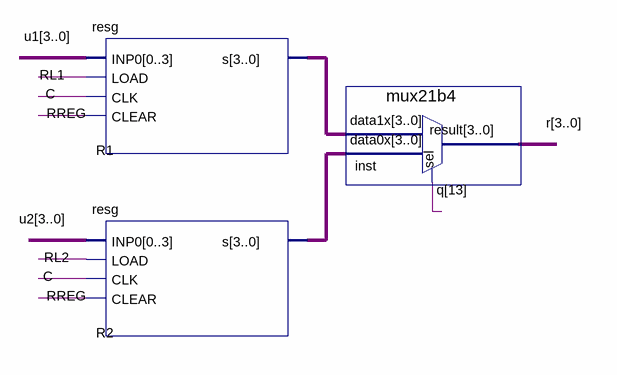
[diagram p0: schematic sheet]
// Quartus schematic RESGITRADORES.bdf as structural Verilog: 3 symbols, 0 pins
module RESGITRADORES (
);

  wire C, RL1, RL2, RREG;
  wire [3:0] r, R1_s, R2_s, u1, u2;
  wire [13:13] q;

  resg R1 (.INP0(u1), .LOAD(RL1), .CLK(C), .CLEAR(RREG), .s(R1_s));
  resg R2 (.INP0(u2), .LOAD(RL2), .CLK(C), .CLEAR(RREG), .s(R2_s));
  mux21b4 inst (.data1x(R1_s), .data0x(R2_s), .sel(q[13]), .result(r));
endmodule
